# Altium schematic sheet DAC8728_Output-buffers.SchDoc
size A3; Organization: University of Amsterdam; Address1: Technology Centre; DocumentNumber: 1; SheetNumber: 3; SheetTotal: 4
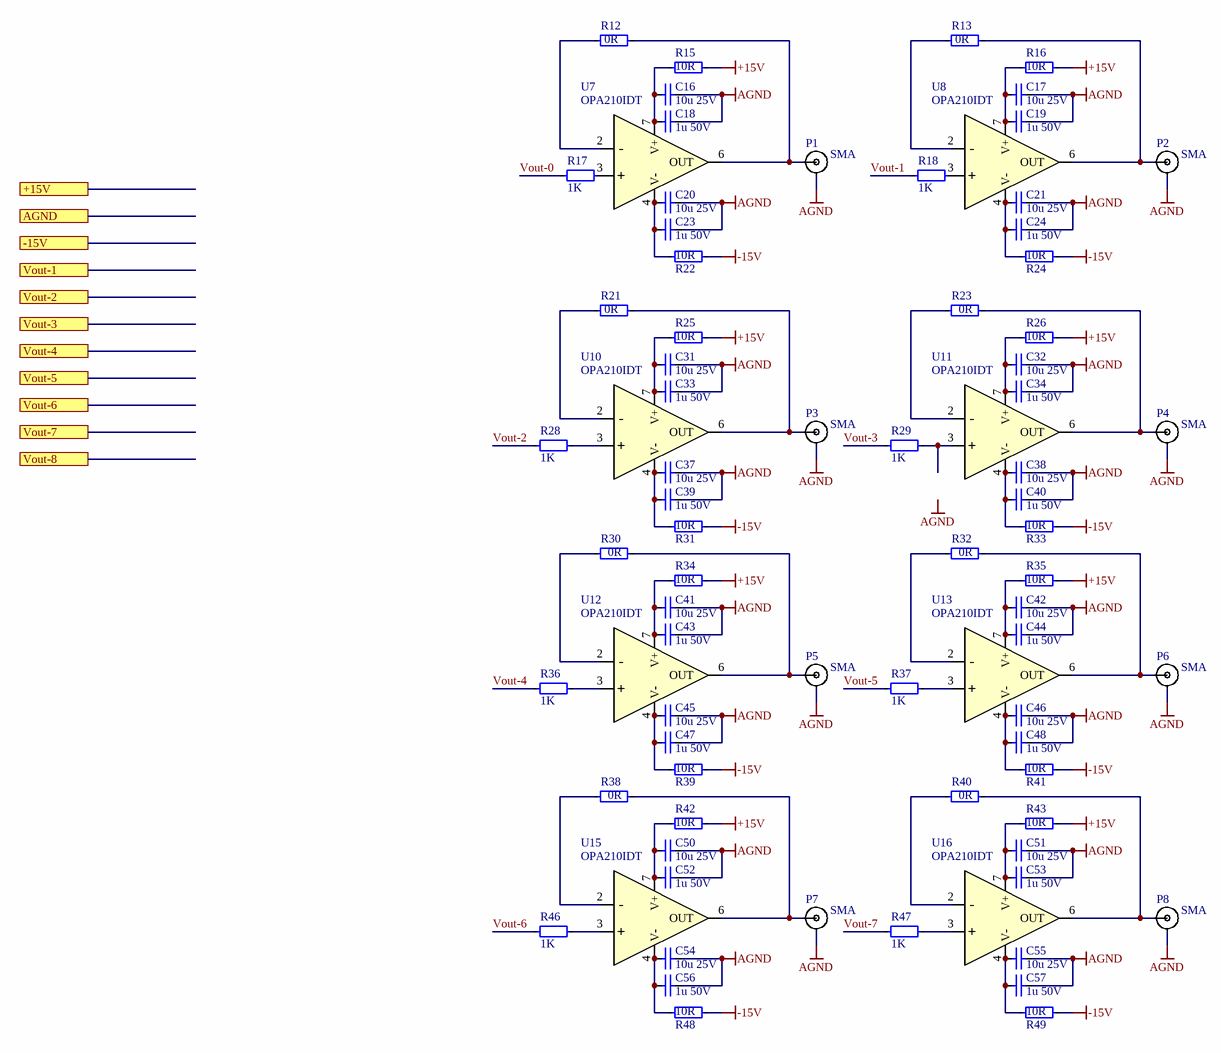
[diagram p0: DAC8728_Output-buffers.SchDoc]

## Parts
C16  10u 25V  [cap0805MD]
C17  10u 25V  [cap0805MD]
C18  1u 50V  [cap0603MD]
C19  1u 50V  [cap0603MD]
C20  10u 25V  [cap0805MD]
C21  10u 25V  [cap0805MD]
C23  1u 50V  [cap0603MD]
C24  1u 50V  [cap0603MD]
C31  10u 25V  [cap0805MD]
C32  10u 25V  [cap0805MD]
C33  1u 50V  [cap0603MD]
C34  1u 50V  [cap0603MD]
C37  10u 25V  [cap0805MD]
C38  10u 25V  [cap0805MD]
C39  1u 50V  [cap0603MD]
C40  1u 50V  [cap0603MD]
C41  10u 25V  [cap0805MD]
C42  10u 25V  [cap0805MD]
C43  1u 50V  [cap0603MD]
C44  1u 50V  [cap0603MD]
C45  10u 25V  [cap0805MD]
C46  10u 25V  [cap0805MD]
C47  1u 50V  [cap0603MD]
C48  1u 50V  [cap0603MD]
C50  10u 25V  [cap0805MD]
C51  10u 25V  [cap0805MD]
C52  1u 50V  [cap0603MD]
C53  1u 50V  [cap0603MD]
C54  10u 25V  [cap0805MD]
C55  10u 25V  [cap0805MD]
C56  1u 50V  [cap0603MD]
C57  1u 50V  [cap0603MD]
P1  SMA  [619540-1]
P2  SMA  [619540-1]
P3  SMA  [619540-1]
P4  SMA  [619540-1]
P5  SMA  [619540-1]
P6  SMA  [619540-1]
P7  SMA  [619540-1]
P8  SMA  [619540-1]
R12  0R  [res0603MD]
R13  0R  [res0603MD]
R15  10R  [res0603MD]
R16  10R  [res0603MD]
R17  1K  [res0603MD]
R18  1K  [res0603MD]
R21  0R  [res0603MD]
R22  10R  [res0603MD]
R23  0R  [res0603MD]
R24  10R  [res0603MD]
R25  10R  [res0603MD]
R26  10R  [res0603MD]
R28  1K  [res0603MD]
R29  1K  [res0603MD]
R30  0R  [res0603MD]
R31  10R  [res0603MD]
R32  0R  [res0603MD]
R33  10R  [res0603MD]
R34  10R  [res0603MD]
R35  10R  [res0603MD]
R36  1K  [res0603MD]
R37  1K  [res0603MD]
R38  0R  [res0603MD]
R39  10R  [res0603MD]
R40  0R  [res0603MD]
R41  10R  [res0603MD]
R42  10R  [res0603MD]
R43  10R  [res0603MD]
R46  1K  [res0603MD]
R47  1K  [res0603MD]
R48  10R  [res0603MD]
R49  10R  [res0603MD]
U7  OPA210IDT  [SOIC127P600X175-8N]
U8  OPA210IDT  [SOIC127P600X175-8N]
U10  OPA210IDT  [SOIC127P600X175-8N]
U11  OPA210IDT  [SOIC127P600X175-8N]
U12  OPA210IDT  [SOIC127P600X175-8N]
U13  OPA210IDT  [SOIC127P600X175-8N]
U15  OPA210IDT  [SOIC127P600X175-8N]
U16  OPA210IDT  [SOIC127P600X175-8N]

## Ports
+15V, -15V, AGND, Vout-1, Vout-2, Vout-3, Vout-4, Vout-5, Vout-6, Vout-7, Vout-8

## Nets
+15V: R15.1 R16.1 R25.1 R26.1 R34.1 R35.1 R42.1 R43.1
-15V: R22.1 R24.1 R31.1 R33.1 R39.1 R41.1 R48.1 R49.1
AGND: C16.2 C17.2 C18.2 C19.2 C20.2 C21.2 C23.2 C24.2 C31.2 C32.2 C33.2 C34.2 C37.2 C38.2 C39.2 C40.2 C41.2 C42.2 C43.2 C44.2 C45.2 C46.2 C47.2 C48.2 C50.2 C51.2 C52.2 C53.2 C54.2 C55.2 C56.2 C57.2 P1.2 P2.2 P3.2 P4.2 P5.2 P6.2 P7.2 P8.2
Vout-0: R17.1
Vout-1: R18.1
Vout-2: R28.1
Vout-3: R29.1
Vout-4: R36.1
Vout-5: R37.1
Vout-6: R46.1
Vout-7: R47.1
NetC16_1: C16.1 C18.1 R15.2 U7.7(V+)
NetC17_1: C17.1 C19.1 R16.2 U8.7(V+)
NetC20_1: C20.1 C23.1 R22.2 U7.4(V-)
NetC21_1: C21.1 C24.1 R24.2 U8.4(V-)
NetC31_1: C31.1 C33.1 R25.2 U10.7(V+)
NetC32_1: C32.1 C34.1 R26.2 U11.7(V+)
NetC37_1: C37.1 C39.1 R31.2 U10.4(V-)
NetC38_1: C38.1 C40.1 R33.2 U11.4(V-)
NetC41_1: C41.1 C43.1 R34.2 U12.7(V+)
NetC42_1: C42.1 C44.1 R35.2 U13.7(V+)
NetC45_1: C45.1 C47.1 R39.2 U12.4(V-)
NetC46_1: C46.1 C48.1 R41.2 U13.4(V-)
NetC50_1: C50.1 C52.1 R42.2 U15.7(V+)
NetC51_1: C51.1 C53.1 R43.2 U16.7(V+)
NetC54_1: C54.1 C56.1 R48.2 U15.4(V-)
NetC55_1: C55.1 C57.1 R49.2 U16.4(V-)
NetP1_1: P1.1 R12.2 U7.6(OUT)
NetP2_1: P2.1 R13.2 U8.6(OUT)
NetP3_1: P3.1 R21.2 U10.6(OUT)
NetP4_1: P4.1 R23.2 U11.6(OUT)
NetP5_1: P5.1 R30.2 U12.6(OUT)
NetP6_1: P6.1 R32.2 U13.6(OUT)
NetP7_1: P7.1 R38.2 U15.6(OUT)
NetP8_1: P8.1 R40.2 U16.6(OUT)
NetR12_1: R12.1 U7.2(-)
NetR13_1: R13.1 U8.2(-)
NetR17_2: R17.2 U7.3(+)
NetR18_2: R18.2 U8.3(+)
NetR21_1: R21.1 U10.2(-)
NetR23_1: R23.1 U11.2(-)
NetR28_2: R28.2 U10.3(+)
NetR29_2: R29.2 U11.3(+)
NetR30_1: R30.1 U12.2(-)
NetR32_1: R32.1 U13.2(-)
NetR36_2: R36.2 U12.3(+)
NetR37_2: R37.2 U13.3(+)
NetR38_1: R38.1 U15.2(-)
NetR40_1: R40.1 U16.2(-)
NetR46_2: R46.2 U15.3(+)
NetR47_2: R47.2 U16.3(+)

## Notes on the sheet
- Labels drawn without touching a wire or pin: AGND
- Project:
- Customer:
- Sheet
- Sheet:
- of
- Revision:

## Library data of the parts
C16 C17 C20 C21 C31 C32 C37 C38 C41 C42 C45 C46 C50 C51 C54 C55 = Cap0805MD_10u_X5R_25V_10%: id: 146; Precision: 10%; Type: 5XR; Author: EB; Partname: Cap0805MD_10u_X5R_25V_10%; MyComment: 10u 25V; Capacitance: 10u; Supplier 1: Farnell; Supplier Part Number 1: 1735530; CreationDate: 31-Mar-16 14:12:18; Checked by: Unchecked; Voltage: 25V
  C16 C20: ClassName: OutBufClass0
  C17 C21: ClassName: OutBufClass1
C18 C19 C23 C24 C33 C34 C39 C40 C43 C44 C47 C48 C52 C53 C56 C57 = Cap0603MD_1u_X5R_50V_10%: id: 123; Precision: 10%; Type: X5R; Author: Twe; Partname: Cap0603MD_1u_X5R_50V_10%; MyComment: 1u 50V; Capacitance: 1u; Supplier 1: Farnell; Supplier Part Number 1: 3013383; CreationDate: 23-Mar-20; Checked by: Unchecked; Voltage: 50V
  C18 C23: ClassName: OutBufClass0
  C19 C24: ClassName: OutBufClass1
P1-P8 = 619540-1: SMA right angle through hole, 19mm, 50 Ohm; Manufacturer: TE connectivity; id: 145; Author: EB; Partname: 619540-1; MyComment: SMA; Type: SMA; ManufacturerCode: 619540-1; Supplier 1: Farnell; Supplier Part Number 1: 3133848; CreationDate: 31-Mar-16 12:11:50; Checked by: Unchecked
R12 R13 R21 R23 R30 R32 R38 R40 = Res0603MD_0R_1%: id: 264; Precision: 1%; Author: Twe; Partname: Res0603MD_0R_1%; MyComment: 0R; Resistance: 0R; Supplier 1: Farnell; Supplier Part Number 1: 2447743; CreationDate: 30-Mar-16 10:33:13; Checked by: Unchecked
R15 R16 R22 R24-R26 R31 R33-R35 R39 R41-R43 R48 R49 = Res0603MD_10R_1%: id: 265; Precision: 1%; Author: Twe; Partname: Res0603MD_10R_1%; MyComment: 10R; Resistance: 10R; Supplier 1: Farnell; Supplier Part Number 1: 2447233; CreationDate: 30-Mar-16 10:33:13; Checked by: Unchecked
R17 R18 R28 R29 R36 R37 R46 R47 = Res0603MD_1K_1%: id: 312; Precision: 1%; Author: Twe; Partname: Res0603MD_1K_1%; MyComment: 1K; Resistance: 1K; Supplier 1: Farnell; Supplier Part Number 1: 2447272; CreationDate: 30-Mar-16 10:33:13; Checked by: Unchecked
U7 U8 U10-U13 U15 U16 = OPA210IDT: UltraLow Noise-drift, high precision, Low-Power, 36-V; Manufacturer: Analog Devices; id: 194; Partname: OPA210IDT; MyComment: OPA210IDT; Type: OpAmp; ManufacturerCode: OPA210IDT; Supplier 1: Mouser; Supplier Part Number 1: 595-OPA210IDT; Author: EB; CreationDate: 05-Jul-22 13:39:52; Checked by: Unchecked